# EAGLE design eink_controller (EAGLE 7.2.0)
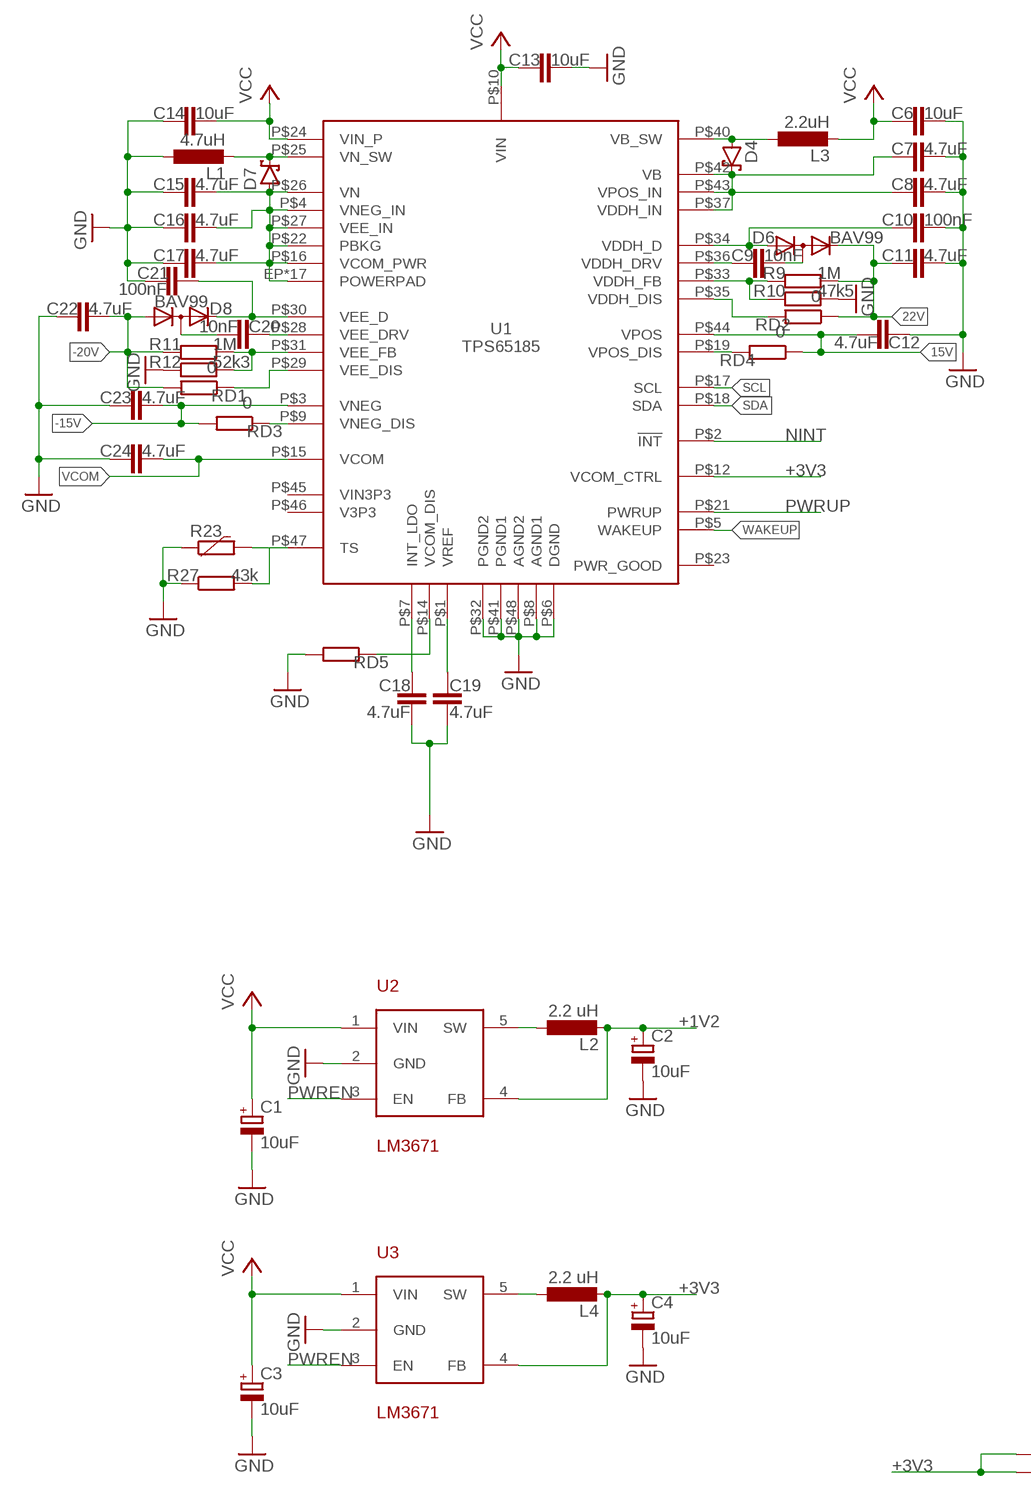
[diagram p0: schematic, sheet 1, part 1 of 2]
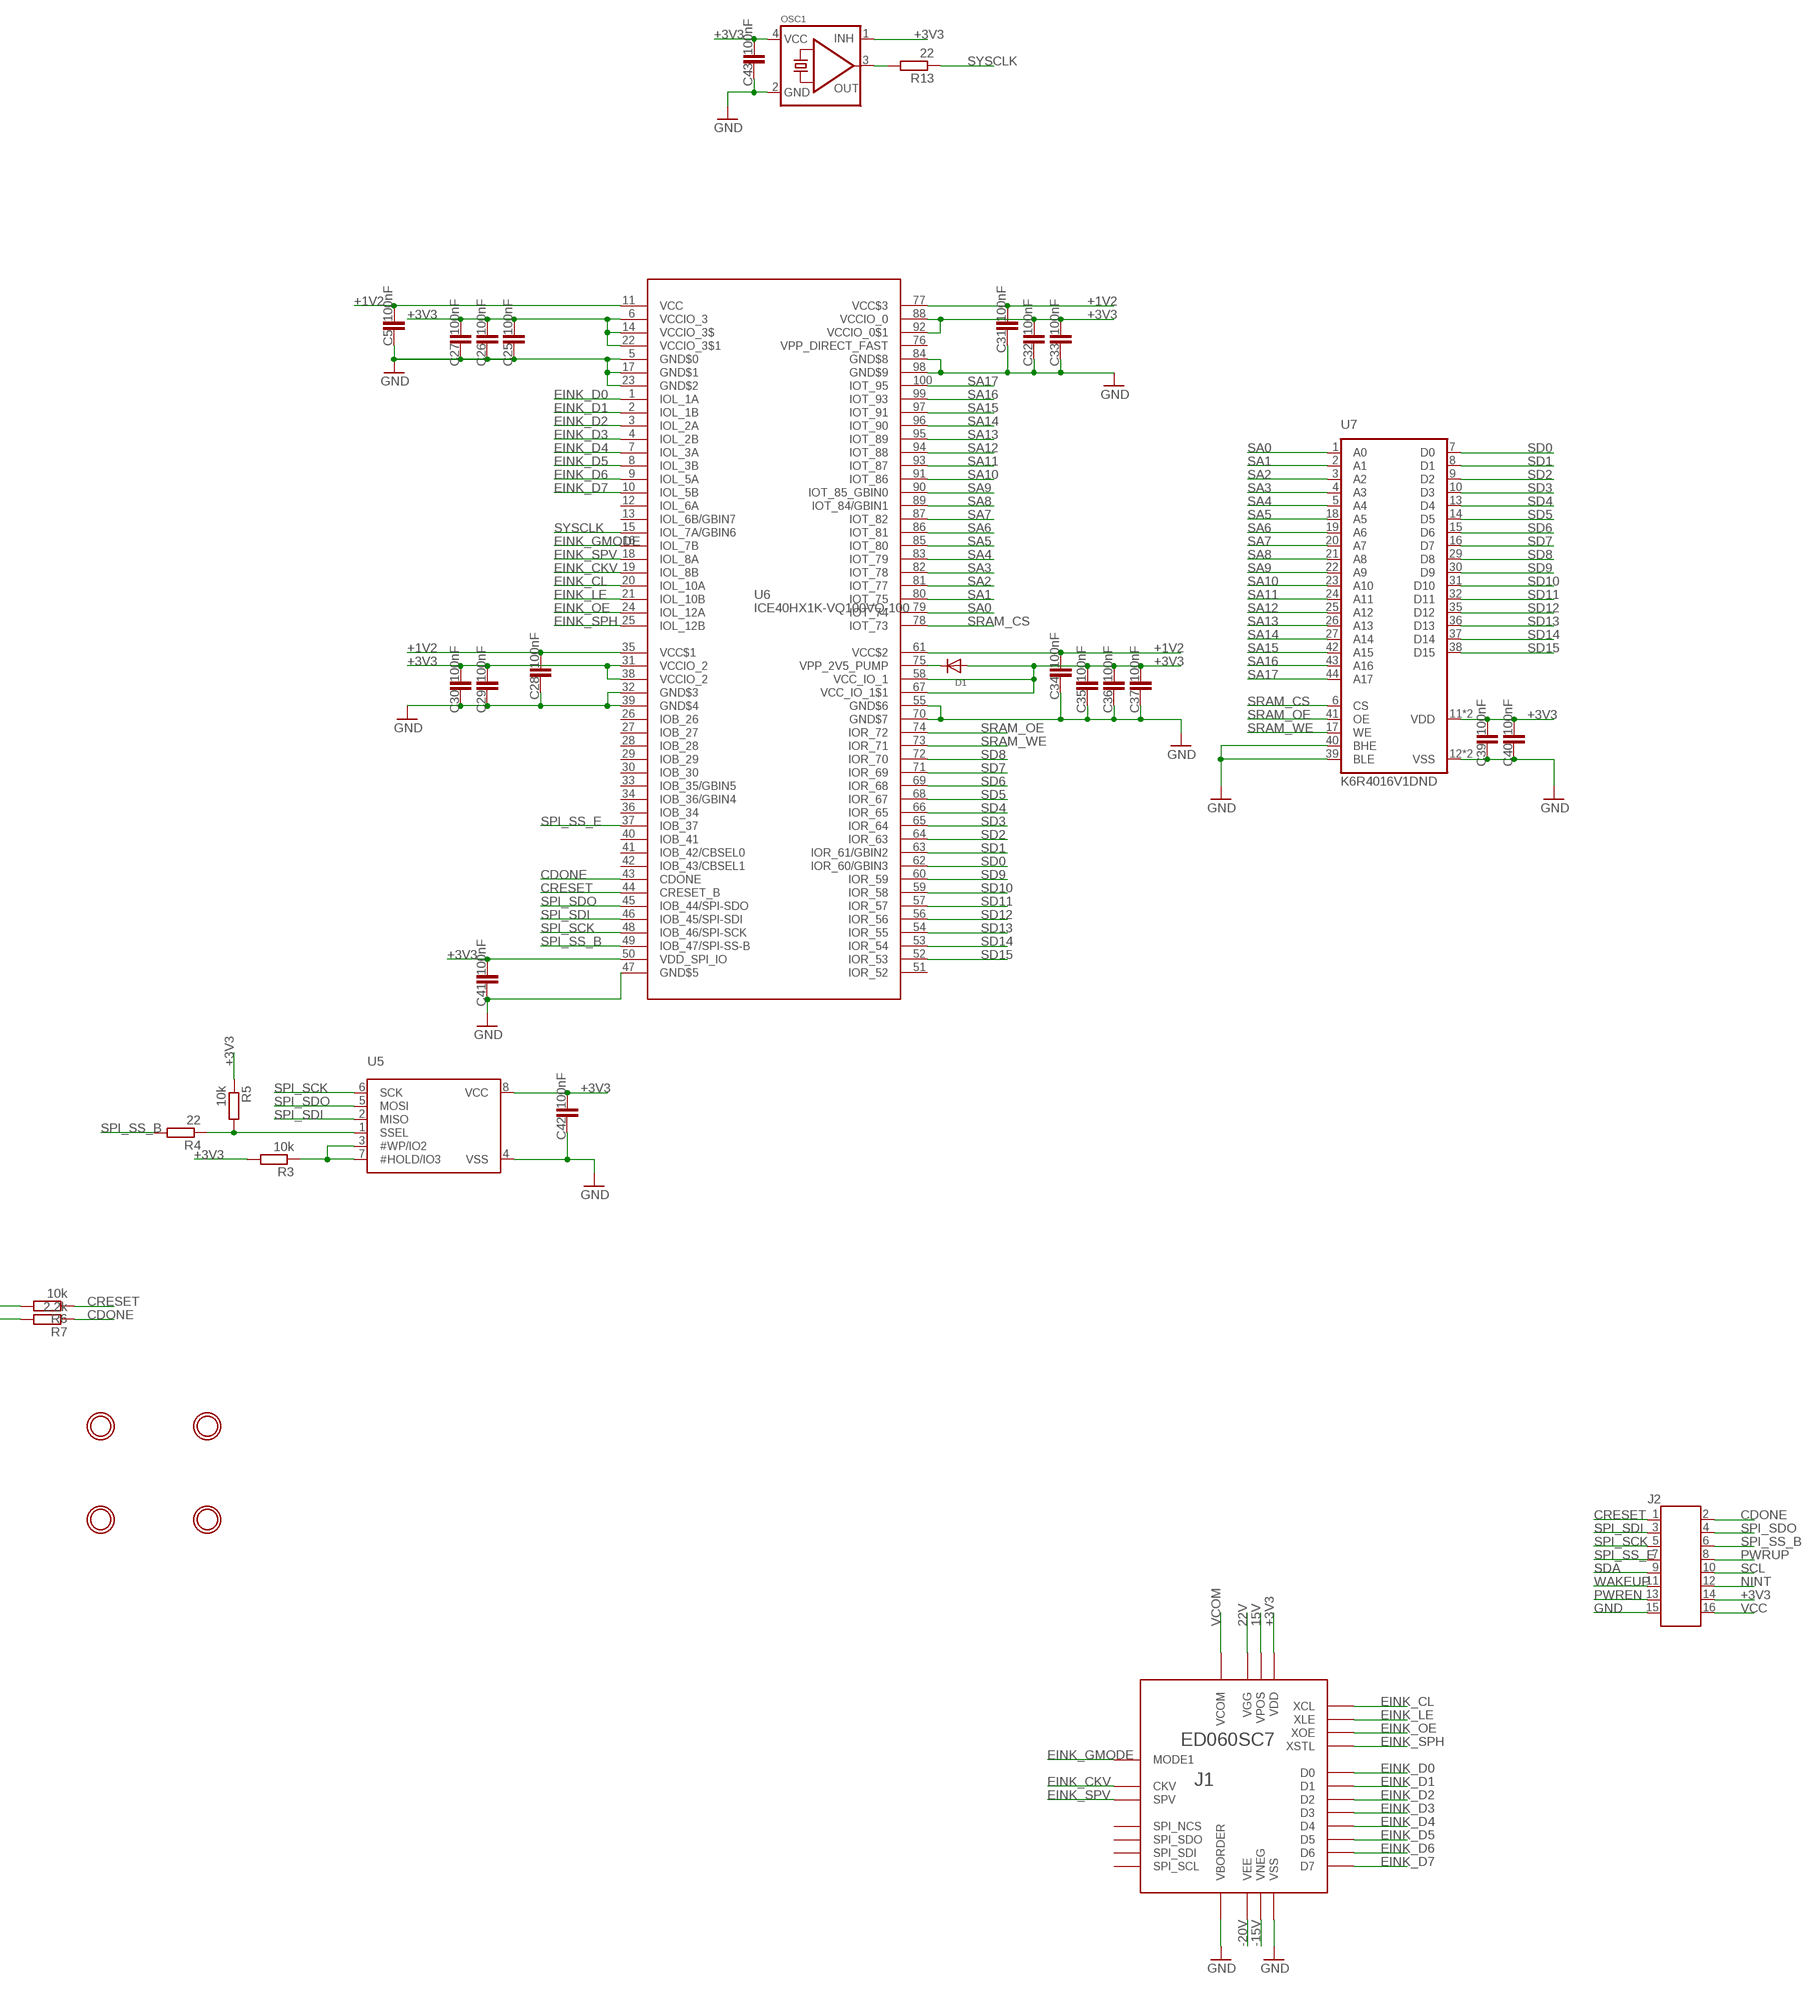
[diagram p1: schematic, sheet 1, part 2 of 2]

## Parts
C1  10uF  CPOL-EUA/3216-18R  [A/3216-18R]
C2  10uF  CPOL-EUA/3216-18R  [A/3216-18R]
C3  10uF  CPOL-EUA/3216-18R  [A/3216-18R]
C4  10uF  CPOL-EUA/3216-18R  [A/3216-18R]
C5  100nF  C-EUC0603K  [C0603K]
C6  10uF  C-EUC0805K  [C0805K]
C7  4.7uF  C-EUC0805K  [C0805K]
C8  4.7uF  C-EUC0805K  [C0805K]
C9  10nF  C-EUC0603K  [C0603K]
C10  100nF  C-EUC0603K  [C0603K]
C11  4.7uF  C-EUC0603K  [C0603K]
C12  4.7uF  C-EUC0805K  [C0805K]
C13  10uF  C-EUC0805K  [C0805K]
C14  10uF  C-EUC0805K  [C0805K]
C15  4.7uF  C-EUC0805K  [C0805K]
C16  4.7uF  C-EUC0805K  [C0805K]
C17  4.7uF  C-EUC0805K  [C0805K]
C18  4.7uF  C-EUC0805K  [C0805K]
C19  4.7uF  C-EUC0805K  [C0805K]
C20  10nF  C-EUC0603K  [C0603K]
C21  100nF  C-EUC0603K  [C0603K]
C22  4.7uF  C-EUC0603K  [C0603K]
C23  4.7uF  C-EUC0805K  [C0805K]
C24  4.7uF  C-EUC0805K  [C0805K]
C25  100nF  C-EUC0603K  [C0603K]
C26  100nF  C-EUC0603K  [C0603K]
C27  100nF  C-EUC0603K  [C0603K]
C28  100nF  C-EUC0603K  [C0603K]
C29  100nF  C-EUC0603K  [C0603K]
C30  100nF  C-EUC0603K  [C0603K]
C31  100nF  C-EUC0603K  [C0603K]
C32  100nF  C-EUC0603K  [C0603K]
C33  100nF  C-EUC0603K  [C0603K]
C34  100nF  C-EUC0603K  [C0603K]
C35  100nF  C-EUC0603K  [C0603K]
C36  100nF  C-EUC0603K  [C0603K]
C37  100nF  C-EUC0603K  [C0603K]
C39  100nF  C-EUC0603K  [C0603K]
C40  100nF  C-EUC0603K  [C0603K]
C41  100nF  C-EUC0603K  [C0603K]
C42  100nF  C-EUC0603K  [C0603K]
C43  100nF  C-EUC0603K  [C0603K]
D1  DIODESOD-123  [SOD-123]
D4  MBR130T3G  [SOD123]
D6  BAV99  BAV199  [SOT23]
D7  MBR130T3G  [SOD123]
D8  BAV99  BAV199  [SOT23]
J1  ED060SC7  [AXT334124]
J2  610116249221  [610116249221]
L1  4.7uH  L-EUL2825P  [L2825P]
L2  2.2 uH  L-EUL2825P  [L2825P]
L3  2.2uH  L-EUL2825P  [L2825P]
L4  2.2 uH  L-EUL2825P  [L2825P]
OSC1  OSCILLATOR  [OSC_7X5MM]
R3  10k  R-EU_R0603  [R0603]
R4  22  R-EU_R0603  [R0603]
R5  10k  R-EU_R0603  [R0603]
R6  10k  R-EU_R0603  [R0603]
R7  2.2k  R-EU_R0603  [R0603]
R9  1M  R-EU_R0603  [R0603]
R10  47k5  R-EU_R0603  [R0603]
R11  1M  R-EU_R0603  [R0603]
R12  52k3  R-EU_R0603  [R0603]
R13  22  R-EU_R0603  [R0603]
R23  R-EU_R0603  [R0603]
R27  43k  R-EU_R0603  [R0603]
RD1  0  R-EU_R0603  [R0603]
RD2  0  R-EU_R0603  [R0603]
RD3  0  R-EU_R0603  [R0603]
RD4  0  R-EU_R0603  [R0603]
RD5  R-EU_R0603  [R0603]
U1  TPS65185  [VQFN48]
U2  LM3671  [SOT23-5]
U3  LM3671  [SOT23-5]
U5  SPIFLASH_SOIC8208MIL  [SOIC8_208MIL]
U6  ICE40HX1K-VQ100VQ-100  [TQFP100]
U7  K6R4016V1DND  [TSOP44-II]
U$1  MOUNTINGHOLE2.0  [MOUNTINGHOLE_2.0_PLATED]
U$2  MOUNTINGHOLE2.0  [MOUNTINGHOLE_2.0_PLATED]
U$3  MOUNTINGHOLE2.0  [MOUNTINGHOLE_2.0_PLATED]
U$4  MOUNTINGHOLE2.0  [MOUNTINGHOLE_2.0_PLATED]

## Nets
15V: C12.2 J1.P$2(VPOS) J1.P$4(VPOS) RD4.1 U1.P$44(VPOS)
22V: C11.1 D6.2(C) J1.P$25(VGG) R9.2 RD2.1
+1V2: C2.+ C5.2 C28.2 C31.2 C34.2 L2.2 U2.4(FB) U6.11(VCC) U6.35(VCC$1) U6.61(VCC$2) U6.77(VCC$3)
+3V3: C4.+ C25.2 C26.2 C27.2 C29.2 C30.2 C32.2 C33.2 C35.2 C36.2 C37.2 C39.2 C40.2 C41.2 C42.2 C43.2 D1.A J1.P$5(VDD) J1.P$7(VDD) J2.14 L4.2 OSC1.1(INH) OSC1.4(VCC) R3.2 R5.1 R6.2 R7.2 U1.P$12(VCOM_CTRL) U3.4(FB) U5.8(VCC) U6.6(VCCIO_3) U6.14(VCCIO_3$) U6.22(VCCIO_3$1) U6.31(VCCIO_2) U6.38(VCCIO_2) U6.50(VDD_SPI_IO) U6.58(VCC_IO_1) U6.67(VCC_IO_1$1) U6.88(VCCIO_0) U6.92(VCCIO_0$1) U7.11(VDD) U7.33(VDD)
-15V: C23.2 J1.P$1(VNEG) J1.P$3(VNEG) RD3.2 U1.P$3(VNEG)
-20V: C22.2 D8.1(A) J1.P$27(VEE) J1.P$29(VEE) R11.1 RD1.2
CDONE: J2.2 R7.1 U6.43(CDONE)
CRESET: J2.1 R6.1 U6.44(CRESET_B)
EINK_CKV: J1.P$28(CKV) U6.19(IOL_8B)
EINK_CL: J1.P$9(XCL) U6.20(IOL_10A)
EINK_D0: J1.P$13(D0) U6.1(IOL_1A)
EINK_D1: J1.P$14(D1) U6.2(IOL_1B)
EINK_D2: J1.P$15(D2) U6.3(IOL_2A)
EINK_D3: J1.P$16(D3) U6.4(IOL_2B)
EINK_D4: J1.P$17(D4) U6.7(IOL_3A)
EINK_D5: J1.P$18(D5) U6.8(IOL_3B)
EINK_D6: J1.P$19(D6) U6.9(IOL_5A)
EINK_D7: J1.P$20(D7) U6.10(IOL_5B)
EINK_GMODE: J1.P$26(MODE1) U6.16(IOL_7B)
EINK_LE: J1.P$10(XLE) U6.21(IOL_10B)
EINK_OE: J1.P$11(XOE) U6.24(IOL_12A)
EINK_SPH: J1.P$12(XSTL) U6.25(IOL_12B)
EINK_SPV: J1.P$30(SPV) U6.18(IOL_8A)
GND: C1.- C2.- C3.- C4.- C5.1 C6.2 C7.2 C8.2 C10.2 C11.2 C12.1 C13.2 C14.1 C15.1 C16.1 C17.1 C18.1 C19.1 C21.1 C22.1 C23.1 C24.1 C25.1 C26.1 C27.1 C28.1 C29.1 C30.1 C31.1 C32.1 C33.1 C34.1 C35.1 C36.1 C37.1 C39.1 C40.1 C41.1 C42.1 C43.1 J1.P$6(VSS) J1.P$8(VSS) J1.P$31(VSS) J1.P$32(VBORDER) J2.15 L1.1 OSC1.2(GND) R10.2 R12.1 R23.1 R27.1 RD5.2 U1.P$6(DGND) U1.P$8(AGND1) U1.P$32(PGND2) U1.P$41(PGND1) U1.P$48(AGND2) U2.2(GND) U3.2(GND) U5.4(VSS) U6.5(GND$0) U6.17(GND$1) U6.23(GND$2) U6.32(GND$3) U6.39(GND$4) U6.47(GND$5) U6.55(GND$6) U6.70(GND$7) U6.84(GND$8) U6.98(GND$9) U7.12(VSS) U7.34(VSS) U7.39(BLE) U7.40(BHE)
N$1: RD5.1 U1.P$14(VCOM_DIS)
N$2: L4.1 U3.5(SW)
N$5: R3.1 U5.3(#WP/IO2) U5.7(#HOLD/IO3)
N$6: OSC1.3(OUT) R13.2
N$7: D4.2(A) L3.1 U1.P$40(VB_SW)
N$8: D1.C U6.75(VPP_2V5_PUMP)
N$9: L2.1 U2.5(SW)
N$10: R4.1 R5.2 U5.1(SSEL)
N$14: C7.1 C8.1 D4.1(C) U1.P$37(VDDH_IN) U1.P$42(VB) U1.P$43(VPOS_IN)
N$18: C10.1 D6.1(A) U1.P$34(VDDH_D)
N$20: C9.1 U1.P$36(VDDH_DRV)
N$21: C9.2 D6.3(AC)
N$22: R9.1 R10.1 U1.P$33(VDDH_FB)
N$23: C20.2 D8.3(AC)
N$24: D7.1(C) L1.2 U1.P$25(VN_SW)
N$25: C15.2 C16.2 C17.2 D7.2(A) U1.EP1(POWERPAD) U1.EP2(POWERPAD) U1.EP3(POWERPAD) U1.EP4(POWERPAD) U1.EP5(POWERPAD) U1.EP6(POWERPAD) U1.EP7(POWERPAD) U1.EP8(POWERPAD) U1.EP9(POWERPAD) U1.EP10(POWERPAD) U1.EP11(POWERPAD) U1.EP12(POWERPAD) U1.EP13(POWERPAD) U1.EP14(POWERPAD) U1.EP15(POWERPAD) U1.EP16(POWERPAD) U1.EP(POWERPAD) U1.P$4(VNEG_IN) U1.P$16(VCOM_PWR) U1.P$22(PBKG) U1.P$26(VN) U1.P$27(VEE_IN)
N$26: C18.2 U1.P$7(INT_LDO)
N$27: C19.2 U1.P$1(VREF)
N$28: C21.2 D8.2(C) U1.P$30(VEE_D)
N$29: RD3.1 U1.P$9(VNEG_DIS)
N$31: C20.1 U1.P$28(VEE_DRV)
N$32: R11.2 R12.2 U1.P$31(VEE_FB)
N$33: RD1.1 U1.P$29(VEE_DIS)
N$34: RD4.2 U1.P$19(VPOS_DIS)
N$35: RD2.2 U1.P$35(VDDH_DIS)
N$57: R23.2 R27.2 U1.P$47(TS)
NINT: J2.12 U1.P$2(!INT)
PWREN: J2.13 U2.3(EN) U3.3(EN)
PWRUP: J2.8 U1.P$21(PWRUP)
SA0: U6.79(IOT_74) U7.1(A0)
SA1: U6.80(IOT_75) U7.2(A1)
SA2: U6.81(IOT_77) U7.3(A2)
SA3: U6.82(IOT_78) U7.4(A3)
SA4: U6.83(IOT_79) U7.5(A4)
SA5: U6.85(IOT_80) U7.18(A5)
SA6: U6.86(IOT_81) U7.19(A6)
SA7: U6.87(IOT_82) U7.20(A7)
SA8: U6.89(IOT_84/GBIN1) U7.21(A8)
SA9: U6.90(IOT_85_GBIN0) U7.22(A9)
SA10: U6.91(IOT_86) U7.23(A10)
SA11: U6.93(IOT_87) U7.24(A11)
SA12: U6.94(IOT_88) U7.25(A12)
SA13: U6.95(IOT_89) U7.26(A13)
SA14: U6.96(IOT_90) U7.27(A14)
SA15: U6.97(IOT_91) U7.42(A15)
SA16: U6.99(IOT_93) U7.43(A16)
SA17: U6.100(IOT_95) U7.44(A17)
SCL: J2.10 U1.P$17(SCL)
SD0: U6.62(IOR_60/GBIN3) U7.7(D0)
SD1: U6.63(IOR_61/GBIN2) U7.8(D1)
SD2: U6.64(IOR_63) U7.9(D2)
SD3: U6.65(IOR_64) U7.10(D3)
SD4: U6.66(IOR_65) U7.13(D4)
SD5: U6.68(IOR_67) U7.14(D5)
SD6: U6.69(IOR_68) U7.15(D6)
SD7: U6.71(IOR_69) U7.16(D7)
SD8: U6.72(IOR_70) U7.29(D8)
SD9: U6.60(IOR_59) U7.30(D9)
SD10: U6.59(IOR_58) U7.31(D10)
SD11: U6.57(IOR_57) U7.32(D11)
SD12: U6.56(IOR_56) U7.35(D12)
SD13: U6.54(IOR_55) U7.36(D13)
SD14: U6.53(IOR_54) U7.37(D14)
SD15: U6.52(IOR_53) U7.38(D15)
SDA: J2.9 U1.P$18(SDA)
SPI_SCK: J2.5 U5.6(SCK) U6.48(IOB_46/SPI-SCK)
SPI_SDI: J2.3 U5.2(MISO) U6.46(IOB_45/SPI-SDI)
SPI_SDO: J2.4 U5.5(MOSI) U6.45(IOB_44/SPI-SDO)
SPI_SS_B: J2.6 R4.2 U6.49(IOB_47/SPI-SS-B)
SPI_SS_E: J2.7 U6.37(IOB_37)
SRAM_CS: U6.78(IOT_73) U7.6(CS)
SRAM_OE: U6.74(IOR_72) U7.41(OE)
SRAM_WE: U6.73(IOR_71) U7.17(WE)
SYSCLK: R13.1 U6.15(IOL_7A/GBIN6)
VCC: C1.+ C3.+ C6.1 C13.1 C14.2 J2.16 L3.2 U1.P$10(VIN) U1.P$24(VIN_P) U2.1(VIN) U3.1(VIN)
VCOM: C24.2 J1.P$21(VCOM) J1.P$23(VCOM) U1.P$15(VCOM)
WAKEUP: J2.11 U1.P$5(WAKEUP)
Unconnected: J1.P$22(SPI_SCL) J1.P$24(SPI_SDI) J1.P$33(SPI_NCS) J1.P$34(SPI_SDO) U1.P$23(PWR_GOOD) U1.P$45(VIN3P3) U1.P$46(V3P3) U6.12(IOL_6A) U6.13(IOL_6B/GBIN7) U6.26(IOB_26) U6.27(IOB_27) U6.28(IOB_28) U6.29(IOB_29) U6.30(IOB_30) U6.33(IOB_35/GBIN5) U6.34(IOB_36/GBIN4) U6.36(IOB_34) U6.40(IOB_41) U6.41(IOB_42/CBSEL0) U6.42(IOB_43/CBSEL1) U6.51(IOR_52)

## Power pins joined to a net without a drawn wire
VPP_DIRECT_FAST: U6.76(VPP_DIRECT_FAST)

## Library data of the parts
C1-C4 = rcl:CPOL-EU: POLARIZED CAPACITOR, European symbol
C5-C37 C39-C43 = rcl:C-EU: CAPACITOR, European symbol
D1 = adafruit:DIODE: Diode SMADIODE - SMA Surface Mount Package 20V 1A Schottky Diode Digikey: 641-1014-6-ND DO-1N4148 - Through Hole Small Current Diode SOD-123 20V 1 A (.5mV Vf) Schottky Diode - Digikey: MBRX120TPMSCT-ND SOD-323 10V 570mA (.38mV Vf, 3ns) Schottky Diode - Digikey: ZLLS410CT-ND SOD-523 30V 30mA Schottky Diode (RB751S-40TE61) - Digikey: RB751S-40TE61CT-ND SOT23-R/W - SOT23 Package (R = Solder Paste/Reflow Ovens, W = Hand-Soldering) BAT54Film 40V 300mA - Digikey: 497-7162-1-ND
D4 D7 = aalectronics:MBR130T3G
D6 D8 = diode:BAV199: DIODE low-leakage double diode
J1 = AXT334124:ED060SC7
J2 = Wurth_Elektronik_Electromechanic_Board_to_Board_Connectors_rev16b:610116249221: WR-PHD 2.54 mm Dual Socket Header 16 pins, dual pin, SMT horizontal, gold plating ;=>Code : Con_BTB_SHD_2.54_2_6101xx249221_610116249221 <http://katalog.we-online.de/media/images/eican/Con_BTB_SHD_2.54_2_6101xx249221_pf2.jpg> Details see: http://katalog.we-online.de/em/datasheet/6101xx249221.pdf Created 2014-10-08, Karrer Zheng 2014 (C) Wurth Elektronik
L1-L4 = rcl:L-EU: INDUCTOR, European symbol
OSC1 = microbuilder:OSCILLATOR: Oscillators 3.2x2.5mm SMT 4.0MHz +/- 50ppm, 3.3V, 9mA, -40/+85°C - Digikey: 535-9752-1-ND 50MHz +/- 50ppm, 3.3V, 8mA, -10/+70°C - Digikey: 478-4792-1-ND 5x7mm SMT 4.0MHz +/-20ppm 3.3V, 20mA, -20/+70°C - Digikey: 535-9329-2-ND 50MHz +/- 25ppm 3.3V, 35mA, -40/+85°C - Digikey: 631-1197-1-ND
R3-R7 R9-R13 R23 R27 RD1-RD5 = rcl:R-EU_: RESISTOR, European symbol
U1 = aalectronics:TPS65185
U2 U3 = texas-custom:LM3671: Texas Instruments LM3671, LM3671Q 2MHz, 600mA Step-Down DC-DC Converter
U5 = microbuilder:SPIFLASH_SOIC8: SOIC8 SPI Flash Be careful with the size since SOIC8 flash comes in several 'widths' SOIC8 150 mil M25P16 - 16Mbit (2Mbit x 8) Serial Flash (75MHz SPI Bus), Supply: 2.7-3.6V Digikey: SOIC8 - M25P16-VMN6P-ND SOIC8 208 mil W25Q16BVSSIG - 16Mbit (2Mbit x 8) Serial Flash (104MHz SPI Bus), Supply: 2.7-3.6V Digikey: SOIC8 - W25Q16BVSSIG-ND
U6 = ice40hx1k-vq100-2:ICE40HX1K-VQ100: FPGA - Field Programmable Gate Array iCE40HX 1280 LUTs, 1.2V Ultra Low-Power, TQFP/VQ-100 package
U7 = sram-256x16:K6R4016V1D: 4 Mbit (256K x16) 3.0V Asynchronous SRAM; OC_FARNELL: unknown; OC_NEWARK: unknown
U$1-U$4 = microbuilder:MOUNTINGHOLE: Mounting Hole For #2 screws (0.086"/2.18mm width, 0.094"/2.4mm hole) use 2.5mm

## Net classes
2 VCC: width 0.305 mm
3 VBUS: width 0.508 mm

## Board
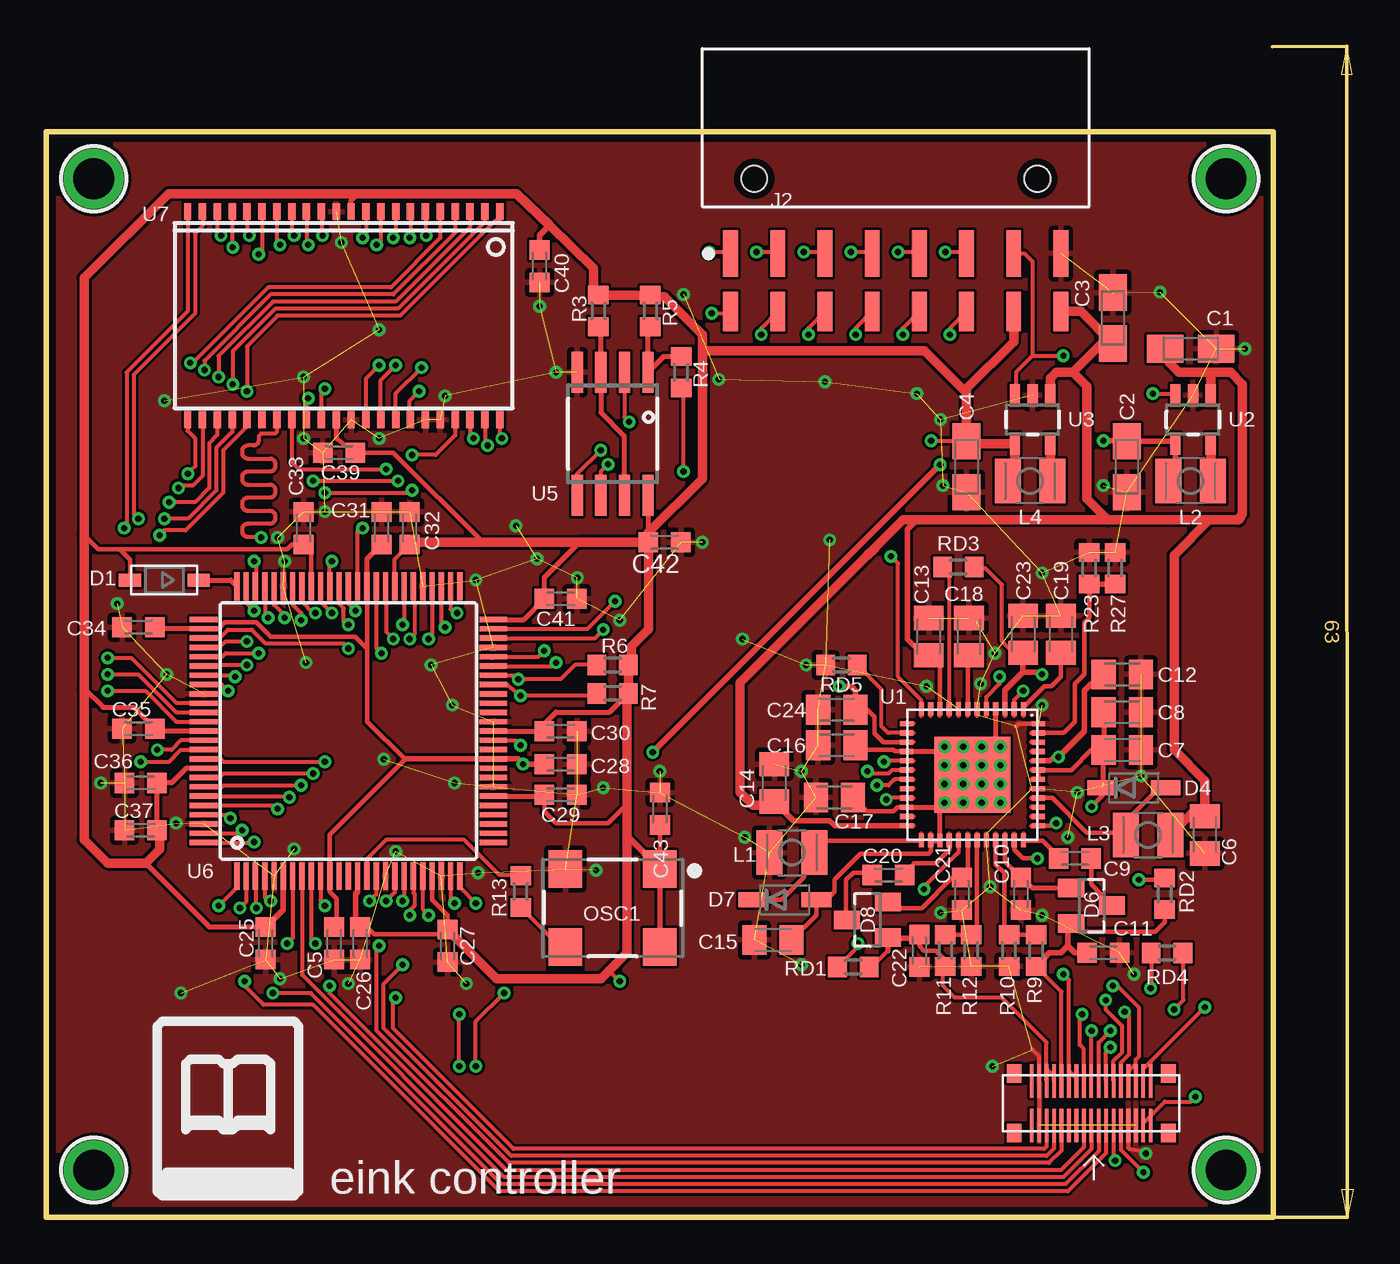
[diagram p2: board, top side]
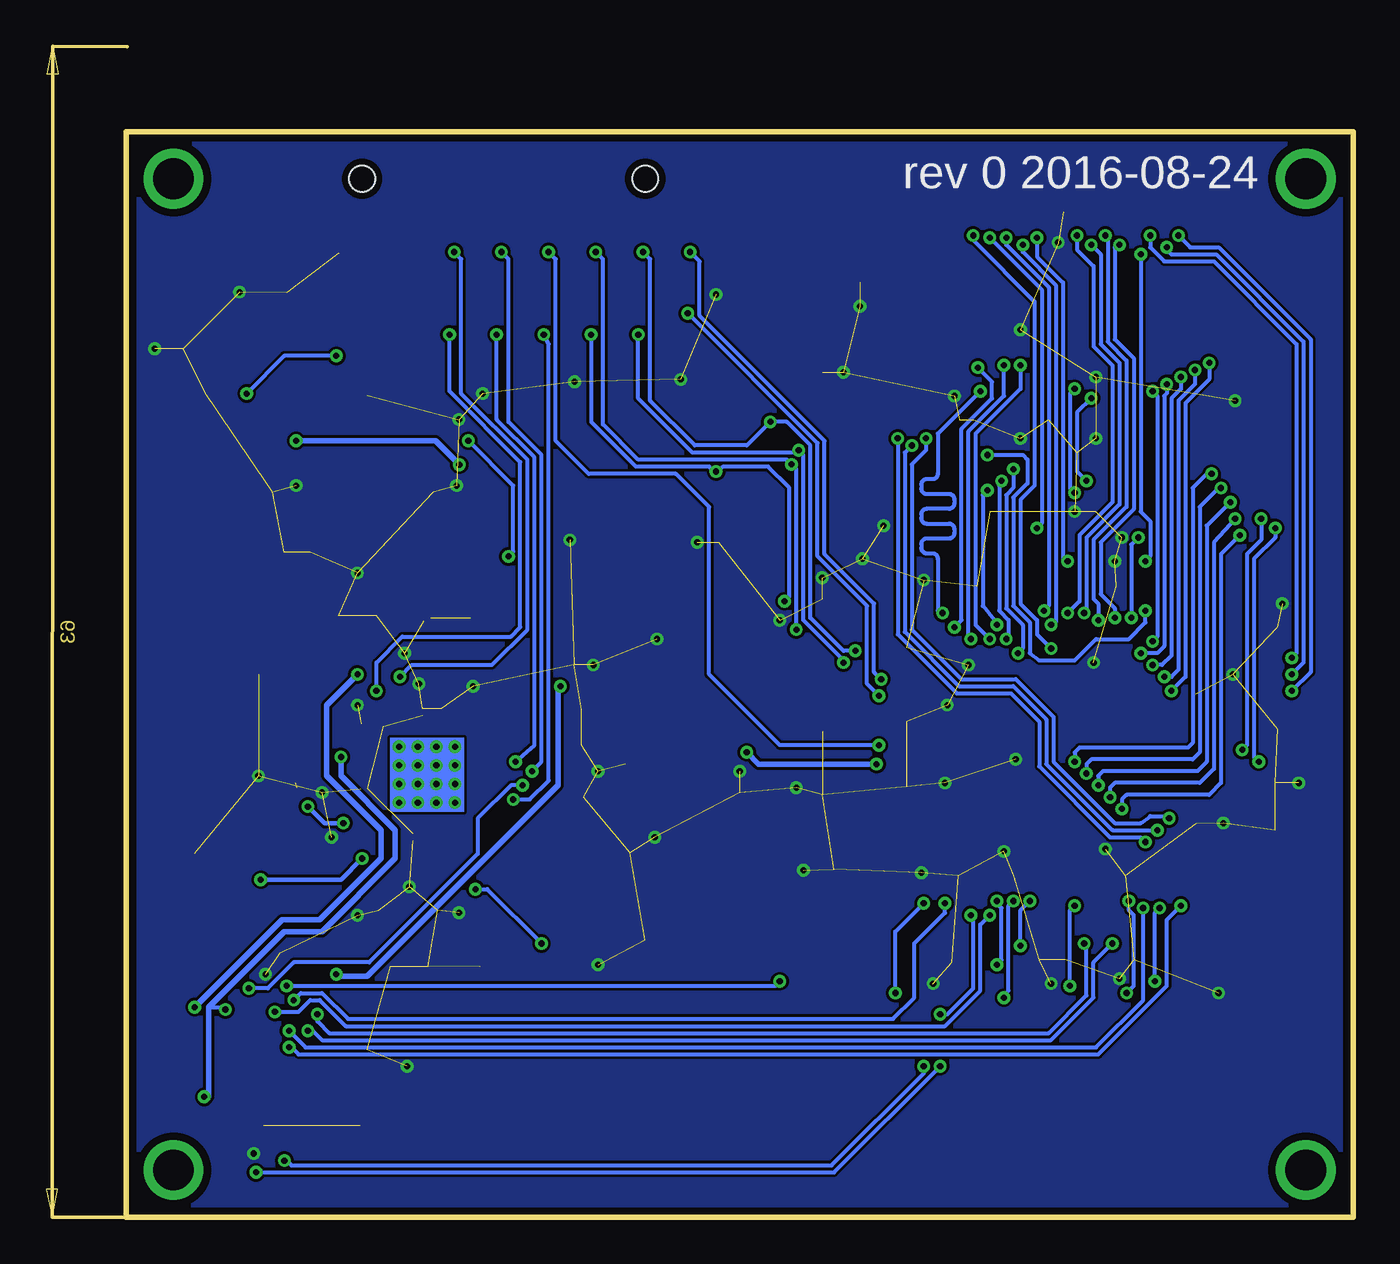
[diagram p3: board, bottom side, seen from below]

Size 66.04 x 58.42 mm. Coordinates in mm from the lower left corner, seen from the top.
Outline: 0,0 0,58.42 66.04,58.42 66.04,0 0,0
Copper layers (1*16): Top 0.0356mm / dielectric 1.5011mm / Bottom 0.0356mm
Design rules "LaenPCBOrder": minimum track width 6mil, minimum drill 13mil, track to track 6mil, track to pad 6mil, pad to pad 6mil, via to via 6mil, smd to smd 6mil, copper to edge 15mil, drill to drill 6mil, minimum pad ring 7mil, minimum via ring 7mil, stop-mask expansion 3mil, vias tented up to drill 0mil, thermal gap 10mil

### Footprints (pad centres in the part's own frame; a part is rotated, then mirrored left to right if it is on the bottom)
A/3216-18R = smd 1.95 x 1.5: + 1.375,0; - -1.375,0
C0603K = smd 1.05 x 1.08: 1 -0.875,0; 2 0.875,0
C0805K = smd 1.3 x 1.6: 1 -1,0; 2 1,0
SOD-123 = smd 1.2 x 0.7: A 1.85,0; C -1.85,0
SOD123 = smd 1.6 x 0.8: 1 -1.7,0; 2 1.7,0
SOT23 = smd 1 x 1.4: 1 -0.95,-1.1; 2 0.95,-1.1; 3 0,1.1
AXT334124 = smd 0.2 x 1.8: P$1 1.518,0.284; P$2 1.518,2.684; P$3 1.918,0.284; P$4 1.918,2.684; P$5 2.318,0.284; P$6 2.318,2.684; P$7 2.718,0.284; P$8 2.718,2.684; P$9 3.118,0.284; P$10 3.118,2.684; P$11 3.518,0.284; P$12 3.518,2.684; P$13 3.918,0.284; P$14 3.918,2.684; P$15 4.318,0.284; P$16 4.318,2.684; P$17 4.718,0.284; P$18 4.718,2.684; P$19 5.118,0.284; P$20 5.118,2.684; P$21 5.518,0.284; P$22 5.518,2.684; P$23 5.918,0.284; P$24 5.918,2.684; P$25 6.318,0.284; P$26 6.318,2.684; P$27 6.718,0.284; P$28 6.718,2.684; P$29 7.118,0.284; P$30 7.118,2.684; P$31 7.518,0.284; P$32 7.518,2.684; P$33 7.918,0.284; P$34 7.918,2.684 | smd 0.8 x 1: TERM$1 0.568,3.084; TERM$2 0.568,-0.116; TERM$3 8.868,3.084; TERM$4 8.868,-0.116
610116249221 = smd 0.8 x 2.5: 1 -8.89,-4.01; 3 -6.35,-4.01; 5 -3.81,-4.01; 7 -1.27,-4.01; 9 1.27,-4.01; 11 3.81,-4.01; 13 6.35,-4.01; 15 8.89,-4.01 | smd 0.8 x 2.1: 2 -8.89,-7.14; 4 -6.35,-7.14; 6 -3.81,-7.14; 8 -1.27,-7.14; 10 1.27,-7.14; 12 3.81,-7.14; 14 6.35,-7.14; 16 8.89,-7.14 | hole 1.4: -7.62,0; 7.62,0
L2825P = smd 1.4 x 2.4: 1 -1.2,0; 2 1.2,0
OSC_7X5MM = smd 1.8 x 2: 1 -2.54,-2.1; 2 2.54,-2.1; 3 2.54,2.1; 4 -2.54,2.1
R0603 = smd 1 x 1.1: 1 -0.85,0; 2 0.85,0
VQFN48 = smd 4.1 x 4.1: EP 0,0 | drill 0.33: EP1 -1.5,1.5; EP2 -0.5,1.5; EP3 0.5,1.5; EP4 1.5,1.5; EP5 1.5,0.5; EP6 1.5,-0.5; EP7 1.5,-1.5; EP8 0.5,-1.5; EP9 -0.5,-1.5; EP10 -1.5,-1.5; EP11 -1.5,-0.5; EP12 -1.5,0.5; EP13 0.5,-0.5; EP14 -0.5,0.5; EP15 0.5,0.5; EP16 -0.5,-0.5 | smd 0.71 x 0.28: P$1 -3.545,2.75; P$2 -3.545,2.25; P$3 -3.545,1.75; P$4 -3.545,1.25; P$5 -3.545,0.75; P$6 -3.545,0.25; P$7 -3.545,-0.25; P$8 -3.545,-0.75; P$9 -3.545,-1.25; P$10 -3.545,-1.75; P$11 -3.545,-2.25; P$12 -3.545,-2.75; P$25 3.545,-2.75; P$26 3.545,-2.25; P$27 3.545,-1.75; P$28 3.545,-1.25; P$29 3.545,-0.75; P$30 3.545,-0.25; P$31 3.545,0.25; P$32 3.545,0.75; P$33 3.545,1.25; P$34 3.545,1.75; P$35 3.545,2.25; P$36 3.545,2.75 | smd 0.28 x 0.71: P$13 -2.75,-3.545; P$14 -2.25,-3.545; P$15 -1.75,-3.545; P$16 -1.25,-3.545; P$17 -0.75,-3.545; P$18 -0.25,-3.545; P$19 0.25,-3.545; P$20 0.75,-3.545; P$21 1.25,-3.545; P$22 1.75,-3.545; P$23 2.25,-3.545; P$24 2.75,-3.545; P$37 2.75,3.545; P$38 2.25,3.545; P$39 1.75,3.545; P$40 1.25,3.545; P$41 0.75,3.545; P$42 0.25,3.545; P$43 -0.25,3.545; P$44 -0.75,3.545; P$45 -1.25,3.545; P$46 -1.75,3.545; P$47 -2.25,3.545; P$48 -2.75,3.545
SOT23-5 = smd 0.55 x 1.2: 1 -0.95,-1.3; 2 0,-1.3; 3 0.95,-1.3; 4 0.95,1.3; 5 -0.95,1.3
SOIC8_208MIL = smd 0.6 x 2.2: 1 -1.905,-3.315; 2 -0.635,-3.315; 3 0.635,-3.315; 4 1.905,-3.315; 5 1.905,3.315; 6 0.635,3.315; 7 -0.635,3.315; 8 -1.905,3.315
TQFP100 = smd 1.5 x 0.285: 1 -7.8,6; 2 -7.8,5.5; 3 -7.8,5; 4 -7.8,4.5; 5 -7.8,4; 6 -7.8,3.5; 7 -7.8,3; 8 -7.8,2.5; 9 -7.8,2; 10 -7.8,1.5; 11 -7.8,1; 12 -7.8,0.5; 13 -7.8,0; 14 -7.8,-0.5; 15 -7.8,-1; 16 -7.8,-1.5; 17 -7.8,-2; 18 -7.8,-2.5; 19 -7.8,-3; 20 -7.8,-3.5; 21 -7.8,-4; 22 -7.8,-4.5; 23 -7.8,-5; 24 -7.8,-5.5; 25 -7.8,-6; 51 7.8,-6; 52 7.8,-5.5; 53 7.8,-5; 54 7.8,-4.5; 55 7.8,-4; 56 7.8,-3.5; 57 7.8,-3; 58 7.8,-2.5; 59 7.8,-2; 60 7.8,-1.5; 61 7.8,-1; 62 7.8,-0.5; 63 7.8,0; 64 7.8,0.5; 65 7.8,1; 66 7.8,1.5; 67 7.8,2; 68 7.8,2.5; 69 7.8,3; 70 7.8,3.5; 71 7.8,4; 72 7.8,4.5; 73 7.8,5; 74 7.8,5.5; 75 7.8,6 | smd 0.285 x 1.5: 26 -6,-7.8; 27 -5.5,-7.8; 28 -5,-7.8; 29 -4.5,-7.8; 30 -4,-7.8; 31 -3.5,-7.8; 32 -3,-7.8; 33 -2.5,-7.8; 34 -2,-7.8; 35 -1.5,-7.8; 36 -1,-7.8; 37 -0.5,-7.8; 38 0,-7.8; 39 0.5,-7.8; 40 1,-7.8; 41 1.5,-7.8; 42 2,-7.8; 43 2.5,-7.8; 44 3,-7.8; 45 3.5,-7.8; 46 4,-7.8; 47 4.5,-7.8; 48 5,-7.8; 49 5.5,-7.8; 50 6,-7.8; 76 6,7.8; 77 5.5,7.8; 78 5,7.8; 79 4.5,7.8; 80 4,7.8; 81 3.5,7.8; 82 3,7.8; 83 2.5,7.8; 84 2,7.8; 85 1.5,7.8; 86 1,7.8; 87 0.5,7.8; 88 0,7.8; 89 -0.5,7.8; 90 -1,7.8; 91 -1.5,7.8; 92 -2,7.8; 93 -2.5,7.8; 94 -3,7.8; 95 -3.5,7.8; 96 -4,7.8; 97 -4.5,7.8; 98 -5,7.8; 99 -5.5,7.8; 100 -6,7.8
TSOP44-II = smd 0.4 x 0.9: 1 -8.4,-5.6; 2 -7.6,-5.6; 3 -6.8,-5.6; 4 -6,-5.6; 5 -5.2,-5.6; 6 -4.4,-5.6; 7 -3.6,-5.6; 8 -2.8,-5.6; 9 -2,-5.6; 10 -1.2,-5.6; 11 -0.4,-5.6; 12 0.4,-5.6; 13 1.2,-5.6; 14 2,-5.6; 15 2.8,-5.6; 16 3.6,-5.6; 17 4.4,-5.6; 18 5.2,-5.6; 19 6,-5.6; 20 6.8,-5.6; 21 7.6,-5.6; 22 8.4,-5.6; 23 8.4,5.6; 24 7.6,5.6; 25 6.8,5.6; 26 6,5.6; 27 5.2,5.6; 28 4.4,5.6; 29 3.6,5.6; 30 2.8,5.6; 31 2,5.6; 32 1.2,5.6; 33 0.4,5.6; 34 -0.4,5.6; 35 -1.2,5.6; 36 -2,5.6; 37 -2.8,5.6; 38 -3.6,5.6; 39 -4.4,5.6; 40 -5.2,5.6; 41 -6,5.6; 42 -6.8,5.6; 43 -7.6,5.6; 44 -8.4,5.6
MOUNTINGHOLE_2.0_PLATED = drill 2.2 pad 3: P$1 0,0

### Placement (x,y rotation side)
C1  61.59,46.74 180 top
C2  58.17,40.39 90 top
C3  57.4,48.39 270 top
C4  49.53,40.39 90 top
C5  15.49,14.73 90 top
C6  62.36,20.57 270 top
C7  57.91,25.15 0 top
C8  57.91,27.18 0 top
C9  55.37,19.3 0 top
C10  52.45,17.4 270 top
C11  56.9,14.22 0 top
C12  57.91,29.21 180 top
C13  47.5,31.24 90 top
C14  39.18,23.37 270 top
C15  39.12,14.92 0 top
C16  42.55,25.4 0 top
C17  42.42,22.59 0 top
C18  49.66,31.24 270 top
C19  54.61,31.37 270 top
C20  45.34,18.41 180 top
C21  49.28,17.4 90 top
C22  46.99,14.35 90 top
C23  52.58,31.37 270 top
C24  42.55,27.3 0 top
C25  11.81,14.73 90 top
C26  16.89,14.73 90 top
C27  21.59,14.61 90 top
C28  27.69,24.38 180 top
C29  27.69,22.73 180 top
C30  27.69,26.16 180 top
C31  18.03,37.08 270 top
C32  19.56,37.08 270 top
C33  13.84,37.08 270 top
C34  4.95,31.75 0 top
C35  4.95,26.29 0 top
C36  5.08,23.37 0 top
C37  5.08,20.83 0 top
C39  15.75,41.15 0 top
C40  26.54,51.18 90 top
C41  27.69,33.27 180 top
C42  33.27,36.32 180 top
C43  33.02,21.97 270 top
D1  6.35,34.29 180 top
D4  58.55,23.11 0 top
D6  56.26,16.76 270 top
D7  39.75,17.08 0 top
D8  44.2,16 90 top
J1  60.96,7.62 180 top
J2  45.72,55.88 0 top
L1  40.13,19.62 0 top
L2  61.59,39.62 180 top
L3  59.31,20.57 0 top
L4  52.96,39.62 180 top
OSC1  30.48,16.64 180 top
R3  29.72,48.77 90 top
R4  34.16,45.47 270 top
R5  32.51,48.77 270 top
R6  30.48,29.72 0 top
R7  30.48,28.19 0 top
R9  53.28,14.35 270 top
R10  51.82,14.35 270 top
R11  48.39,14.35 90 top
R12  49.78,14.35 90 top
R13  25.53,17.53 270 top
R23  56.13,34.92 270 top
R27  57.53,34.92 270 top
RD1  43.43,13.46 0 top
RD2  60.2,17.4 90 top
RD3  49.09,34.99 0 top
RD4  60.33,14.22 180 top
RD5  42.8,29.72 180 top
U1  49.85,23.81 270 top
U2  61.72,42.93 180 top
U3  53.09,42.93 180 top
U5  30.48,42.16 180 top
U6  16.26,26.16 90 top
U7  16,48.51 180 top
U$1  2.54,2.54 0 top
U$2  63.5,2.54 0 top
U$3  63.5,55.88 0 top
U$4  2.54,55.88 0 top

### Tracks (layer width: path | path; a pad name or v marks a point on that pad's centre or on a via)
15V  (via drill 0.33)
  Top 0.203: J1.P$2 59.44,5.47 | 59.44,5.47 60.2,6.22 61.59,6.22 v61.85,6.48 | J1.P$4 59.04,5.07 59.44,5.47 | v60.71,11.18 61.21,11.68 61.21,14.19 RD4.1
  Top 0.254: 53.04,24.56 U1.P$44
  Top 0.305: U1.P$44 54.03,24.56 54.23,24.77 v54.48,24.77 55.88,26.16 55.88,28.32 56.26,28.7 C12.2
  Top 0.508: 56.62,28.89 C12.2
  Bottom 0.203: 61.59,11.3 60.83,11.3 v60.71,11.18
  Bottom 0.305: v54.48,24.77 54.48,23.75 51.56,20.83 51.56,19.3 55.5,15.37 57.53,15.37 61.59,11.3 61.59,6.48 v61.85,6.48
22V
  Top 0.203: J1.P$25 54.64,12.14 R9.2
  Top 0.254: D6.2 55.61,15.37 59.69,15.37 60.2,15.88 RD2.1
  Top 0.305: 54.99,14.61 54.99,15.38 D6.2 | 54.99,14.61 54.61,14.22 54,14.22 R9.2 | C11.1 55.37,14.22 54.99,14.61
+1V2  (via drill 0.33)
  Top 0.254: 9.26,31.66 9.6,32 11.3,32 12.06,31.24 16.62,31.24 17.27,30.59 | 17.27,30.59 17.27,26.67 19.28,24.66 19.33,24.66 15.24,20.57 15.24,18.38 15.24,17.53 15.62,17.14 15.62,15.86 C5.2 | 17.27,30.59 17.27,33.95 U6.61
  Top 0.279: 15.24,18.38 U6.11 | U6.61 17.26,35.43 C31.2 | C34.2 5.99,31.66 U6.77 9.26,31.66
  Top 0.305: C28.2 v25.65,24.38 25.38,24.66 U6.35 19.33,24.66 | v48.11,40.49 v32.64,25.02 | v56.9,41.78 58.17,41.78 C2.+ 60.59,41.75 U2.4 60.77,40 L2.2
  Bottom 0.305: v32.64,25.02 32,24.38 v25.65,24.38 | v56.9,41.78 49.4,41.78 v48.11,40.49
+3V3  (via drill 0.33)
  Top 0.203: U6.58 18.76,35.41 C32.2 19.54,36.32 | v57.4,12.45 57.66,12.45 58.8,11.3 58.8,8.64 58.64,8.48 58.64,8.26 | v30.86,12.7 30.29,13.27 | 58.24,8.11 J1.P$7 58.24,7.86 58.64,8.26 | J1.P$5 58.64,8.26 | U1.P$12 47.1,27.83 45.85,29.08 45.85,35.18 v45.47,35.56 | v47.62,41.78 49.51,41.78 C4.+
  Top 0.254: C39.2 18.67,41.15 23.5,36.32 | C33.2 13.83,35.94 | C33.2 13.22,36.21 12.95,35.94 3.94,35.94 | 3.94,35.94 2.79,35.94 2.03,36.7 | D1.A 4.5,35.38 3.94,35.94 | U6.67 14.26,36.05 C33.2 | C26.2 17.03,15.86 17.65,15.24 21.1,15.24 C27.2 21.59,16.26 20.76,17.09 U6.22 | C43.2 OSC1.1 | C29.2 26.81,21.83 27.43,21.21 30.23,21.21 31.24,22.23
  Top 0.279: 31.24,28.11 30.31,27.18 27.43,27.18 26.81,26.56 C30.2 U6.38 | U6.31 26.75,22.66 C29.2 | U6.50 25.7,32.16 C41.2 26.81,34.43 28.7,36.32 | 16.76,15.87 C26.2 | C37.2 C36.2 6.73,23.37 7.53,24.16 U6.92 | C25.2 8.78,15.61 5.33,19.05 | U7.33 15.6,41.91 C39.2 | U7.11 16.4,54.72 16.76,55.09 | 2.03,28.45 3.05,27.43 4.68,27.43 C35.2 5.96,26.16 U6.88 | D1.A 4.95,34.29 | U5.8 32.38,36.83 32.38,36.34
  Top 0.305: C40.2 26.54,52.84 27.07,53.38 | U6.14 16.76,17.52 16.64,17.4 16.64,15.99 C26.2 | 31.24,20.52 OSC1.1 OSC1.4 | U6.6 12.76,16.55 C25.2
  Top 0.406: 30.48,13.46 30.61,13.59
  Top 0.508: 32.38,36.34 C42.2 | C42.2 32.4,31.64 31.5,30.73 31.5,29.88 R6.2 R7.2 31.24,28.11 31.24,22.23 31.24,20.52 31.24,14.22 30.61,13.59 30.29,13.27 29.84,12.83 24.24,12.83 C27.2 | C42.2 28.7,36.32 23.5,36.32 19.54,36.32 | C37.2 6.1,20.69 6.1,19.81 5.33,19.05 3.3,19.05 2.03,20.32 2.03,28.45 2.03,36.7 2.03,50.55 6.57,55.09 16.76,55.09 25.31,55.09 27.07,53.38 29.46,51.05 29.46,49.87 R3.2 R5.1 32.6,49.53 33.27,49.53 35.31,47.5 35.31,46.74 | 35.31,46.74 35.31,39.74 32.38,36.83 C42.2 | OSC1.1 32.45,18.74 | 35.31,46.74 35.53,46.63 47.27,46.63 49.53,44.37 | 49.53,44.37 C4.+ 49.66,41.63 U3.4 52.14,40 L4.2 | 49.53,44.37 49.53,44.58 52.07,47.12 J2.14
  Bottom 0.203: v57.4,12.45 31.11,12.45 v30.86,12.7 | v45.47,35.56 45.21,35.81 45.21,39.37 v47.62,41.78
-15V  (via drill 0.33)
  Top 0.203: 52.56,30.37 52.05,30.37 51.44,30.99 51.44,34.04 50.55,34.92 50,34.92 RD3.2 | J1.P$1 59.44,8.39 | 59.44,8.39 v62.36,11.3 | J1.P$3 59.04,7.99 59.44,8.39
  Top 0.305: C23.2 52.56,30.37 | 52.7,30.23 52.58,30.35 C23.2 | U1.P$3 51.6,28.36 52.58,29.34 | 52.58,29.34 C23.2 | 52.58,29.34 53.47,29.34 v53.59,29.21
  Bottom 0.305: v53.59,29.21 55.24,27.56 55.24,23.75 52.32,20.83 52.32,19.3 55.63,16 57.66,16 v62.36,11.3
-20V
  Top 0.203: RD1.2 44.41,13.46 45.3,14.35 | J1.P$29 53.84,8 | 53.84,8 53.84,9.4 51.44,11.81 48.9,11.81 48.26,12.45 48.26,13.37 R11.1 | J1.P$27 54.24,7.6 53.84,8
  Top 0.254: C22.2 46.99,14.61 47.24,14.35 47.88,14.35 48.51,13.72 48.39,13.59 R11.1
  Top 0.305: C22.2 46.56,15.02 45.63,15.02 D8.1 45.3,14.35
CDONE  (via drill 0.33)
  Top 0.203: R7.1 29.5,28.07 v25.53,28.07 24.8,28.66 U6.43 | 36.8,48.77 J2.2 36.73,48.64 v35.81,48.64
  Bottom 0.203: v25.53,28.07 26.16,28.7 26.16,32.89 28.83,35.56 28.83,41.66 v35.81,48.64
CRESET  (via drill 0.33)
  Top 0.203: U6.44 25.19,29.16 v25.4,28.96 27.69,28.96 28.45,29.72 R6.1 | 36.78,51.82 J2.1 36.76,51.94 v35.69,51.94
  Bottom 0.203: v25.4,28.96 25.78,29.34 25.78,33.02 28.45,35.69 28.45,41.78 35.18,48.51 35.18,51.44 v35.69,51.94
EINK_CKV  (via drill 0.33)
  Top 0.203: J1.P$28 54.24,3.7 53.85,3.3 25.02,3.3 18.16,10.16 18.16,12.57 v19.18,13.59 | U6.19 19.26,17.19 v19.18,17.02
  Bottom 0.203: v19.18,13.59 18.92,13.84 18.92,16.64 19.18,16.89 v19.18,17.02
EINK_CL  (via drill 0.33)
  Top 0.203: J1.P$9 57.84,8.31 58.29,8.76 58.29,10.79 v58.04,11.05 | U6.20 19.76,17.45 19.81,17.4 19.81,16.76 19.56,16.51 v19.56,16.26
  Bottom 0.203: v58.04,11.05 56.77,11.05 56.13,11.68 55.63,11.68 54.23,10.29 21.97,10.29 20.07,12.19 20.07,15.75 v19.56,16.26
EINK_D0  (via drill 0.33)
  Top 0.203: J1.P$13 57.04,8.91 v57.28,9.14 | U6.1 10.26,17.75 v9.27,16.76
  Bottom 0.203: v57.28,9.14 57.15,9.14 56.77,8.76 13.72,8.76 10.03,12.45 10.03,16 v9.27,16.76
EINK_D1  (via drill 0.33)
  Top 0.203: J1.P$14 57.04,3.45 54.99,1.4 24.38,1.4 14.35,11.43 11.68,11.43 10.67,12.45 v10.67,12.7 | U6.2 10.76,16.98 v10.41,16.64
  Bottom 0.203: v10.67,12.7 10.67,16.38 v10.41,16.64
EINK_D2  (via drill 0.33)
  Top 0.203: J1.P$15 56.64,9.4 v57.28,10.03 | U6.3 11.26,16.68 v11.3,16.64
  Bottom 0.203: v57.28,10.03 56.39,9.14 13.84,9.14 11.3,11.68 v11.3,16.64
EINK_D3  (via drill 0.33)
  Top 0.203: J1.P$16 56.64,3.56 54.86,1.78 24.51,1.78 14.22,12.06 v12.19,12.06 | U6.4 11.76,17.2 v12.06,17.02
  Bottom 0.203: v12.19,12.06 11.81,12.45 11.81,16.26 12.06,16.51 v12.06,17.02
EINK_D4  (via drill 0.33)
  Top 0.203: J1.P$17 56.24,10.01 v56.26,10.03 | U6.7 13.26,15.03 v12.95,14.73
  Bottom 0.203: v56.26,10.03 56.01,10.03 55.5,9.53 16.26,9.53 13.97,11.81 13.97,13.72 v12.95,14.73
EINK_D5
  Top 0.203: J1.P$18 56.24,3.66 54.74,2.16 24.64,2.16 13.76,13.04 U6.8
EINK_D6  (via drill 0.33)
  Top 0.203: J1.P$19 55.84,9.05 55.63,9.27 55.63,10.79 v55.75,10.92 | U6.9 14.26,14.95 v14.48,14.73
  Bottom 0.203: v55.75,10.92 55.75,10.54 55.12,9.91 16.38,9.91 14.35,11.94 14.35,14.61 v14.48,14.73
EINK_D7  (via drill 0.33)
  Top 0.203: J1.P$20 55.84,3.77 54.61,2.54 24.77,2.54 15.24,12.06 v15.24,12.45 | U6.10 14.76,17.04 v14.99,16.76
  Bottom 0.203: v15.24,12.45 15.24,16.51 v14.99,16.76
EINK_GMODE  (via drill 0.33)
  Top 0.203: J1.P$26 54.64,3.59 53.98,2.92 24.89,2.92 17.78,10.03 17.78,14.35 17.91,14.48 v17.91,14.61 | U6.16 17.76,17.38 v17.4,17.02
  Bottom 0.203: v17.91,14.61 17.91,16.51 v17.4,17.02
EINK_LE  (via drill 0.33)
  Top 0.203: J1.P$10 57.84,3.63 v59.05,2.41 | v22.23,8.13 v22.23,10.92 | U6.21 20.26,16.57 v20.57,16.26
  Bottom 0.203: v59.05,2.41 27.94,2.41 v22.23,8.13 | v22.23,10.92 21.84,10.92 20.45,12.32 20.45,16.13 v20.57,16.26
EINK_OE  (via drill 0.33)
  Top 0.203: J1.P$11 57.44,8.42 57.91,8.89 57.91,10.29 57.02,11.18 v57.02,11.68 | U6.24 21.76,17.06 v21.97,16.89
  Bottom 0.203: v57.02,11.68 56.64,12.06 55.5,12.06 54.1,10.67 24.77,10.67 23.62,11.81 23.62,14.73 21.97,16.38 v21.97,16.89
EINK_SPH  (via drill 0.33)
  Top 0.203: J1.P$12 57.44,3.21 v57.53,3.05 | v23.11,8.13 23.11,10.54 v24.64,12.06 | U6.25 22.26,17.75 v23.11,16.89
  Bottom 0.203: v57.53,3.05 57.4,3.05 57.15,2.79 28.07,2.79 23.11,7.75 v23.11,8.13 | v24.64,12.06 24.64,15.37 v23.11,16.89
EINK_SPV  (via drill 0.33)
  Top 0.203: J1.P$30 53.84,3.8 53.72,3.68 25.15,3.68 18.67,10.16 18.67,11.68 v18.8,11.81 | U6.18 18.76,17.49 v18.29,17.02
  Bottom 0.203: v18.8,11.81 18.8,11.94 18.54,12.19 18.54,16.76 v18.29,17.02
GND  (via drill 0.33, 0.33 pad 0.69)  (137 unrouted)
  Top 0.203: 53.09,9.02 53.44,8.66 J1.P$31 J1.P$32 | J1.P$8 58.24,3.73 58.29,3.68 59.05,3.56 v59.18,3.43
  Top 0.254: U1.P$48 52.34,26.56 52.2,26.42
  Top 0.279: C18.1 50.04,32.07
  other vias: 55.5,22.86 40.64,24 27.43,45.47 37.47,31.11 53.59,16.26 40.64,13.59 41.91,44.96 53.59,34.67 56.9,39.37 23.24,18.54 35.31,36.32 30.86,32.13 21.84,27.56 28.57,34.42 13.34,19.81 13.84,41.91 2.92,23.37 15.88,52.45 3.81,33.02 23.11,34.29 13.97,29.84 6.48,29.21 14.99,37.97 6.99,21.21 17.91,41.91 21.46,44.2 13.84,45.21 29.97,23.11 21.97,23.37 12.45,36.58 12.83,35.31 64.52,46.74 48.26,39.37 48.13,42.93 18.16,24.64 20.7,29.72 26.42,35.43 25.27,37.21 17.91,47.75 6.35,43.94 26.54,49.02 34.29,49.66 18.8,19.68 42.16,36.45 53.59,27.56 50.29,28.7 50.8,17.78 46.86,44.32 58.93,23.75 36.2,45.09 16.26,12.57 7.24,12.06 12.57,12.83 59.94,49.78 33.02,24 48.13,16.38 40.89,29.72 47.37,28.57 29.59,18.67 54.99,20.45 51.05,30.35 50.93,8.13 22.61,12.57 37.59,20.45 58.55,13.08
  pour Bottom: -30.48,101.6 -30.48,-6.35 83.82,-6.35 83.82,101.6
  pour Top: -35.56,106.68 -35.56,-11.43 88.9,-11.43 88.9,106.68
N$1
  Top 0.203: U1.P$14 45.31,26.06 44.96,26.42 44.96,28.41 RD5.1
N$2
  Top 0.508: U3.5 54.04,39.11 L4.1
N$5
  Top 0.279: R3.1 29.84,47.79 U5.3 29.84,43.31 31.11,42.04 U5.7
N$6
  Top 0.203: OSC1.3 27.67,14.54 R13.2
N$7
  Top 0.254: U1.P$40 54.15,22.56 56.01,20.7 57.47,20.7 L3.1 57.84,21.04 | 57.78,21.14 57.84,21.04 | D4.2 59.91,23.11 57.84,21.04
N$8
  Top 0.279: D1.C 9.93,34.29 U6.75
N$9
  Top 0.508: U2.5 62.67,40.13 L2.1
N$10
  Top 0.279: R5.2 32.38,47.79 U5.1 33.22,46.32 R4.1
N$14  (via drill 0.33)  (1 unrouted)
  Top 0.254: C7.1 56.24,25.15 55.16,24.06 U1.P$43 U1.P$42 | U1.P$37 54.21,21.06 v54.36,21.21 | 56.85,23.04 D4.1 56.85,22.68 v56.26,22.1
  Top 0.279: C8.1 C7.1 56.9,24.89 56.9,23.5 56.91,23.38
  Bottom 0.254: v54.36,21.21 55.37,21.21 v56.26,22.1
N$18
  Top 0.254: U1.P$34 51.6,19.13 C10.1
  Top 0.279: D6.1 53.09,17.71 C10.1
N$20
  Top 0.254: U1.P$36 53.65,20.27 54.48,19.43 C9.1
N$21
  Top 0.254: D6.3 56.26,17.91 56.26,19.16 C9.2
N$22
  Top 0.254: U1.P$33 51.1,19.01 51.56,18.54 51.56,15.33 R10.1 R9.1
  Top 0.279: 51.85,15.16 R10.1
N$23
  Top 0.254: 43.05,15.88 43.05,18.16 43.43,18.54 44.4,18.54 C20.2
  Top 0.279: 43.05,15.88 43.18,15.95 D8.3
N$24
  Top 0.254: U1.P$25 41.47,20.27 L1.2 40.77,18.93 40.77,18.29 39.56,17.08 D7.1
N$25
  Top 0.254: U1.P$26 47.62,20.24 47.62,19.68 47.5,19.56 43.81,19.56 42.42,18.16 42.42,17.53 41.85,16.95 D7.2 41.45,16.26 C15.2 | 43.88,25.06 C16.2 43.8,25.15 45.59,25.15 45.68,25.06 U1.P$16 | 43.95,22.06 C17.2 44.16,21.84 45.59,21.84 45.81,22.06 U1.P$22
  Top 0.279: 46.66,25.06 48.26,25.06 | 48.26,25.06 48.6,25.06 U1.EP16 | U1.EP16 U1.EP | 46.66,22.06 49.1,22.06 U1.EP6 | U1.EP7 48.1,22.06 U1.P$27 U1.P$26 47.6,20.29 47.62,20.32 | 51.1,27 51.1,24.79 51.35,24.54 U1.EP2 | U1.EP2 U1.EP1 | U1.EP2 U1.EP14 | U1.EP14 U1.EP12 | U1.EP16 U1.EP13 | U1.EP13 U1.EP15 | U1.EP14 U1.EP15 | U1.EP2 U1.EP3 U1.EP4 | U1.EP5 U1.EP15 | U1.EP6 U1.EP13 | U1.EP7 U1.EP6 | U1.EP8 U1.EP7 | U1.EP9 U1.EP10 | U1.EP10 U1.EP11 | U1.EP10 48.35,25.15 48.26,25.06
N$26
  Top 0.254: U1.P$7 49.6,29.67 C18.2
N$27
  Top 0.254: U1.P$1 52.6,27.45 | 52.6,27.45 52.58,27.43 | 52.6,27.45 53.72,28.57 54.1,28.57 54.61,29.08 C19.2
N$28
  Top 0.254: U1.P$30 49.6,17.96 C21.2 48.75,18.27 47.12,16.64 45.64,16.64 D8.2
N$29
  Top 0.203: U1.P$9 48.6,34.63 RD3.1
N$31
  Top 0.254: U1.P$28 48.6,19.77 47.88,19.05 46.69,19.05 C20.1
N$32
  Top 0.254: U1.P$31 50.1,15.26 R12.2 R11.2
N$33  (via drill 0.33)
  Top 0.203: U1.P$29 49.1,19.63 47.24,17.78 v47.24,17.65 | v43.69,14.73 43.69,14.57 RD1.1
  Bottom 0.203: v47.24,17.65 46.61,17.65 v43.69,14.73
N$34  (via drill 0.33)
  Top 0.203: 46.66,23.56 45.66,23.56 45.34,23.24 v44.7,23.24 | RD4.2 59.48,12.36 v59.44,12.32
  Bottom 0.203: v44.7,23.24 45.34,23.24 47.12,21.46 47.12,19.56 52.96,13.72 57.02,13.72 58.42,12.32 v59.44,12.32
N$35  (via drill 0.33)
  Top 0.254: U1.P$35 52.1,19.79 52.58,19.3 v53.34,19.3 | v58.8,18.16 60.11,18.16 RD2.2
  Bottom 0.254: v53.34,19.3 54.48,18.16 v58.8,18.16
N$57
  Top 0.254: U1.P$47 54.76,26.06 55.37,26.67 55.37,28.7 55.88,29.21 55.88,32 56.13,32.26 R23.2
  Top 0.305: R27.2 R23.2
NINT  (via drill 0.33)
  Top 0.203: U1.P$2 52.1,27.84 v52.58,28.32 | 49.66,48.61 J2.12 48.64,47.85 v48.64,47.5
  Bottom 0.203: v52.58,28.32 52.58,29.84 51.18,31.24 45.34,31.24 44.83,31.75 44.83,40.64 48.64,44.45 v48.64,47.5
PWREN  (via drill 0.33)
  Top 0.203: J2.13 52.65,51.87 53.09,51.44 53.09,46.35 | 53.09,46.35 52.2,45.47 52.2,44.29 U3.3 | 53.09,46.35 v54.74,46.35 | v59.56,44.32 60.67,44.32 U2.3
  Bottom 0.203: v54.74,46.35 57.53,46.35 v59.56,44.32
PWRUP  (via drill 0.33)
  Top 0.203: U1.P$21 45.3,22.56 v45.21,22.48 | v43.56,47.5 43.56,47.85 J2.8
  Bottom 0.203: v45.21,22.48 44.32,22.48 43.31,23.5 43.31,46.99 v43.56,47.5
SA0  (via drill 0.33)
  Top 0.203: v10.79,44.45 10.79,46.86 12.45,48.51 19.05,48.51 24.15,53.61 24.4,53.61 U7.1 | U6.79 9.33,30.66 9.65,30.99 v10.79,30.99
  Bottom 0.203: v10.79,44.45 10.54,44.2 10.54,31.24 v10.79,30.99
SA1  (via drill 0.33)
  Top 0.203: v10.03,44.83 10.03,46.61 12.32,48.9 18.92,48.9 23.6,53.57 U7.2 | U6.80 9.46,30.16 9.65,30.35 v11.43,30.35
  Bottom 0.203: v10.03,44.83 10.03,44.32 10.16,44.2 10.16,30.73 10.54,30.35 v11.43,30.35
SA2  (via drill 0.33)
  Top 0.203: v9.27,45.21 9.27,46.35 12.19,49.28 18.8,49.28 22.8,53.28 U7.3 | U6.81 9.34,29.66 9.4,29.72 v10.79,29.72
  Bottom 0.203: v9.27,45.21 9.27,44.58 9.78,44.07 9.78,30.23 10.29,29.72 v10.79,29.72
SA3  (via drill 0.33)
  Top 0.203: v8.51,45.59 8.51,46.1 12.06,49.66 18.67,49.66 22,52.99 U7.4 | U6.82 10.08,29.16 v10.16,29.08
  Bottom 0.203: v8.51,45.59 8.51,44.83 9.4,43.94 9.4,29.46 9.78,29.08 v10.16,29.08
SA4  (via drill 0.33)
  Top 0.203: v7.75,45.97 7.87,45.97 11.94,50.04 18.54,50.04 21.2,52.7 U7.5 | U6.83 9.44,28.66 v9.78,28.32
  Bottom 0.203: v7.75,45.97 7.75,45.09 9.02,43.81 9.02,29.08 v9.78,28.32
SA5  (via drill 0.33)
  Top 0.203: U7.18 10.8,52.95 v10.92,52.83 | v3.3,30.1 4.57,30.1 6.99,27.69 8.43,27.69 U6.85
  Bottom 0.203: v10.92,52.83 10.92,52.2 10.16,51.44 7.49,51.44 3.05,46.99 3.05,30.35 v3.3,30.1
SA6  (via drill 0.33)
  Top 0.203: U7.19 10,52.23 v10.03,52.2 | v3.3,29.21 4.95,29.21 6.99,27.18 8.44,27.18 U6.86
  Bottom 0.203: v10.03,52.2 10.03,52.07 9.78,51.82 7.37,51.82 2.67,47.12 2.67,29.84 v3.3,29.21
SA7  (via drill 0.33)
  Top 0.203: U7.20 9.2,53.03 v9.4,52.83 | v3.3,28.32 5.33,28.32 6.99,26.67 8.45,26.67 U6.87
  Bottom 0.203: v9.4,52.83 8.76,52.2 7.24,52.2 2.29,47.24 2.29,29.34 v3.3,28.32
SA8  (via drill 0.33)
  Top 0.203: v4.95,37.59 4.7,37.85 4.7,45.34 8,48.64 8,52.96 8.4,53.36 U7.21 | U6.89 8.45,25.65 7.24,25.65 6.73,25.15 v5.97,25.15
  Bottom 0.203: v4.95,37.59 4.95,36.45 5.71,35.69 5.71,25.4 v5.97,25.15
SA9  (via drill 0.33)
  Top 0.203: U7.22 7.6,48.75 4.32,45.47 4.32,37.21 v4.19,37.08 | v5.08,24.51 6.6,24.51 7.24,25.15 8.44,25.15 U6.90
  Bottom 0.203: v4.19,37.08 4.19,36.58 5.33,35.43 5.33,24.77 v5.08,24.51
SA10  (via drill 0.33)
  Top 0.203: v7.62,40.01 7.6,40.11 8,40.39 8,41.91 7.6,42.31 U7.23 | U6.91 9.37,24.66 9.53,24.51 v14.99,24.51
  Bottom 0.203: v7.62,40.01 7.87,40.01 8.64,39.24 8.64,25.53 8.89,25.27 14.73,25.27 14.99,25.02 v14.99,24.51 14.88,24.54
SA11  (via drill 0.33)
  Top 0.203: U7.24 8.4,39.9 7.87,39.37 7.24,39.37 v7.11,39.24 | v14.35,23.88 9.53,23.88 9.27,23.62 8.5,23.62 U6.93
  Bottom 0.203: v7.11,39.24 7.24,39.24 8.26,38.23 8.26,25.02 8.64,24.64 14.1,24.64 14.35,24.38 v14.35,23.88
SA12  (via drill 0.33)
  Top 0.203: v6.6,38.48 8,38.48 8.76,39.24 8.76,41.66 9.2,42.09 U7.25 | U6.94 9.45,23.16 9.53,23.24 v13.72,23.24
  Bottom 0.203: v6.6,38.48 7.87,37.21 7.87,24.51 8.38,24 13.46,24 13.72,23.75 v13.72,23.24
SA13  (via drill 0.33)
  Top 0.203: v6.35,37.59 7.62,37.59 9.14,39.12 9.14,41.4 10,42.26 U7.26 | U6.95 13.03,22.66 v13.08,22.61
  Bottom 0.203: v6.35,37.59 7.49,36.32 7.49,24.13 8.26,23.37 12.83,23.37 13.08,23.11 v13.08,22.61
SA14  (via drill 0.33)
  Top 0.203: v6.1,36.7 6.35,36.96 7.49,36.96 9.53,38.99 9.53,41.27 10.8,42.55 U7.27 | U6.96 12.26,22.16 v12.45,21.97
  Bottom 0.203: v6.1,36.7 7.11,35.69 7.11,23.37 7.75,22.73 12.19,22.73 12.45,22.48 v12.45,21.97
SA15  (via drill 0.33)
  Top 0.203: U7.42 22.8,42.09 v22.99,41.91 | U6.97 9.71,21.66 v9.91,21.46
  Bottom 0.203: v22.99,41.91 22.99,41.27 23.75,40.51 23.75,31.62 21.08,28.96 18.16,28.96 16.13,26.92 16.13,24.51 12.83,21.21 11.43,21.21 10.92,21.59 10.03,21.59 v9.91,21.46
SA16  (via drill 0.33)
  Top 0.203: U7.43 23.6,41.68 v23.75,41.53 | U6.99 10.38,20.66 v10.54,20.83
  Bottom 0.203: v23.75,41.53 24.13,41.15 24.13,31.5 21.21,28.57 18.29,28.57 16.51,26.8 16.51,24.38 12.95,20.83 v10.54,20.83
SA17  (via drill 0.33)
  Top 0.203: U7.44 24.4,42.02 v24.51,41.91 | U6.100 11.14,20.16 v11.18,20.19
  Bottom 0.203: v24.51,41.91 24.51,31.37 21.34,28.19 18.41,28.19 16.89,26.67 16.89,24.26 13.08,20.45 11.43,20.45 v11.18,20.19
SCL  (via drill 0.33)
  Top 0.203: U1.P$17 45.01,24.56 v45.09,24.51 | v46.1,47.5 46.1,47.85 J2.10
  Bottom 0.203: v45.09,24.51 44.07,25.4 44.07,40.89 46.1,42.93 v46.1,47.5
SD0  (via drill 0.33)
  Top 0.203: U7.7 19.6,52.79 v19.56,52.7 | U6.62 16.76,36.95 v17.02,37.08
  Bottom 0.203: v19.56,52.7 16.76,49.91 16.76,37.34 v17.02,37.08
SD1  (via drill 0.33)
  Top 0.203: U7.8 18.8,52.83 v18.67,52.7 | U6.63 16.26,33.02 v16.64,32.64
  Bottom 0.203: v16.64,32.64 16.38,32.89 16.38,50.04 18.67,52.32 v18.67,52.7
SD2  (via drill 0.33)
  Top 0.203: U7.9 18,52.48 v17.78,52.32 | v16.26,31.88 16.01,32.01 16.01,32.76 15.75,33.02 15.75,33.95 U6.64
  Bottom 0.203: v16.26,31.88 16,32 16,50.16 17.78,51.94 v17.78,52.32
SD3  (via drill 0.33)
  Top 0.203: U6.65 15.26,35.2 v15.37,35.31 | U7.10 17.2,52.89 v17.02,52.7
  Bottom 0.203: v17.02,52.7 17.02,51.69 15.62,50.29 15.62,35.43 v15.37,35.31
SD4  (via drill 0.33)
  Top 0.203: U7.13 14.8,52.89 v14.86,52.83 | U6.66 14.73,33.94 14.73,33.15 v15.37,32.51
  Bottom 0.203: v14.86,52.83 14.86,52.07 13.97,51.18 13.97,46.86 12.95,45.85 12.95,38.48 14.73,36.7 14.73,33.15 v15.37,32.51
SD5  (via drill 0.33)
  Top 0.203: U7.14 14,52.42 v14.1,52.32 | U6.68 13.76,33.11 14.35,32.51 v14.48,32.51
  Bottom 0.203: v14.48,32.51 14.35,32.64 14.35,36.58 12.57,38.35 12.57,45.97 13.59,46.99 13.59,51.82 v14.1,52.32
SD6  (via drill 0.33)
  Top 0.203: U7.15 13.2,52.97 v13.34,52.83 | U6.69 13.26,32.97 13.72,32.51 v13.72,32.13
  Bottom 0.203: v13.72,32.13 13.72,33.02 13.97,33.27 13.97,36.45 12.19,38.23 12.19,46.1 13.21,47.12 13.21,52.7 v13.34,52.83
SD7  (via drill 0.33)
  Top 0.203: U7.16 12.4,52.53 v12.57,52.32 | U6.71 12.26,32.96 12.83,32.38 v12.83,32.26
  Bottom 0.203: v12.83,32.26 12.83,32.77 13.59,33.53 13.59,36.32 11.81,38.1 11.81,46.23 12.83,47.24 12.83,52.2 12.7,52.32 v12.57,52.32
SD8  (via drill 0.33)
  Top 0.203: U7.29 12.4,42.25 12.32,42.16 11.56,42.16 11.43,42.04 11.43,41.82 arc-90 11.14,41.53 10.83,41.53 arc90 10.54,41.24 10.54,41.12 arc90 10.83,40.83 12.03,40.83 arc-90 12.32,40.53 12.32,40.42 arc-90 12.03,40.12 10.83,40.12 arc90 10.54,39.83 10.54,39.72 arc90 10.83,39.42 12.03,39.42 arc-90 12.32,39.13 12.32,39.01 arc-90 12.03,38.72 10.83,38.72 arc90 10.54,38.43 10.54,38.31 arc90 10.83,38.02 12.03,38.02 arc-90 12.32,37.73 12.32,37.61 arc-90 12.03,37.32 10.83,37.32 arc90 10.54,37.02 10.54,36.91 arc90 10.83,36.61 11.52,36.61 v11.56,36.58 | v11.94,32.26 11.81,32.38 11.81,33.91 U6.72
  Bottom 0.203: v11.56,36.58 11.94,36.2 v11.94,32.26
SD9  (via drill 0.33)
  Top 0.203: U6.60 17.76,30.63 v18.03,30.35 | v18.29,40.26 13.59,40.26 13.2,40.65 U7.30
  Bottom 0.203: v18.29,40.26 18.29,39.24 18.67,38.86 18.67,32.77 17.78,31.88 17.78,30.61 v18.03,30.35
SD10  (via drill 0.33)
  Top 0.203: U7.31 14,43.97 v14.1,44.07 | U6.59 18.29,33.93 18.29,31.5 v18.67,31.11 | v14.35,39.62 v18.92,39.62
  Bottom 0.203: v18.92,39.62 19.05,39.37 19.05,32.64 18.54,32.13 18.54,31.24 v18.67,31.11 | v14.1,44.07 14.86,43.31 14.86,40.13 v14.35,39.62
SD11  (via drill 0.33)
  Top 0.203: U7.32 14.8,44.39 v14.99,44.58 | v14.99,38.99 19.56,38.99 v19.68,39.12 | U6.57 19.26,31.96 v19.18,31.88
  Bottom 0.203: v19.68,39.12 19.94,38.86 19.94,32.89 19.3,32.13 v19.18,31.88 | v14.99,44.58 15.24,44.32 15.24,39.24 v14.99,38.99
SD12  (via drill 0.33)
  Top 0.203: U6.56 19.76,33.08 19.81,33.02 19.81,31.37 v19.56,31.11 | U7.35 17.2,45.14 v17.91,45.85
  Bottom 0.203: v17.91,45.85 17.91,44.58 20.32,42.16 20.32,31.88 v19.56,31.11
SD13  (via drill 0.33)
  Top 0.203: U6.54 20.76,31.31 v20.57,31.11 | U7.36 18,45.05 v18.8,45.85
  Bottom 0.203: v20.57,31.11 20.7,31.24 20.7,42.29 18.8,44.2 v18.8,45.85
SD14  (via drill 0.33)
  Top 0.203: U6.53 21.26,31.96 v21.46,31.75 | U7.37 18.8,44.33 v20.19,45.72
  Bottom 0.203: v21.46,31.75 21.08,32.13 21.08,42.42 19.43,44.07 19.43,44.96 v20.19,45.72
SD15  (via drill 0.33)
  Top 0.203: U7.38 19.56,42.96 19.56,43.94 v20.07,44.45 | U6.52 21.76,32.73 21.97,32.51 v22.1,32.51
  Bottom 0.203: v22.1,32.51 22.23,32.51 22.35,32.64 22.35,35.43 arc-90 22.64,35.73 22.95,35.73 arc90 23.24,36.02 23.24,36.23 arc90 22.95,36.52 21.75,36.52 arc-90 21.46,36.82 21.46,37.03 arc-90 21.75,37.32 22.95,37.32 arc90 23.24,37.62 23.24,37.83 arc90 22.95,38.12 21.75,38.12 arc-90 21.46,38.41 21.46,38.63 arc-90 21.75,38.92 22.95,38.92 arc90 23.24,39.21 23.24,39.43 arc90 22.95,39.72 22.64,39.72 arc-90 22.35,40.01 22.35,42.16 v20.07,44.45
SDA  (via drill 0.33)
  Top 0.203: U1.P$18 45.53,24.06 45.34,23.88 44.32,23.88 v44.2,24 | v45.85,51.94 46.92,51.94 J2.9
  Bottom 0.203: v44.2,24 43.69,24.51 43.69,41.02 45.47,42.8 45.47,51.56 v45.85,51.94
SPI_SCK  (via drill 0.33)
  Top 0.203: U5.6 29.84,40.13 v30.23,40.51 | v29.97,31.62 29.97,31.59 29.54,31.16 U6.48 24.01,31.11 | 41.86,51.82 J2.5 41.84,51.94 v40.77,51.94
  Bottom 0.203: v29.97,31.62 29.97,40.26 v30.23,40.51 30.48,40.77 38.48,40.77 40.39,42.67 40.39,51.56 v40.77,51.94
SPI_SDI  (via drill 0.33)
  Top 0.203: U5.2 31.11,43.05 v31.37,42.8 | v26.8,30.48 26.48,30.16 U6.46 23.99,30.1 | 39.32,51.82 J2.3 39.3,51.94 v38.23,51.94
  Bottom 0.203: v26.8,30.48 27.43,30.48 29.21,32.26 29.21,41.53 30.48,42.8 v31.37,42.8 32.64,41.53 35.43,41.53 37.85,43.94 37.85,51.56 v38.23,51.94
SPI_SDO  (via drill 0.33)
  Top 0.203: U5.5 28.57,40.01 v29.84,41.27 | v27.43,29.84 27.25,29.66 U6.45 23.98,29.59 | v38.48,47.5 38.48,47.85 J2.4
  Bottom 0.203: v27.43,29.84 27.43,29.97 29.59,32.13 29.59,41.02 v29.84,41.27 29.97,41.27 30.1,41.15 35.56,41.15 38.48,44.07 v38.48,47.5
SPI_SS_B  (via drill 0.33)
  Top 0.203: v34.29,40.13 34.29,44.45 34.16,44.58 R4.2 | U6.49 29.12,31.66 v30.61,33.15 | v41.02,47.5 41.02,47.85 J2.6
  Bottom 0.203: v30.61,33.15 30.35,33.4 30.35,39.24 31.5,40.39 33.91,40.39 v34.29,40.13 34.42,40.13 34.67,40.39 38.61,40.39 41.02,42.8 v41.02,47.5
SPI_SS_E  (via drill 0.33)
  Top 0.203: U6.37 25.27,25.66 v25.53,25.4 | 44.4,51.82 J2.7 44.38,51.94 v43.31,51.94
  Bottom 0.203: v25.53,25.4 30.86,25.4 34.67,29.21 34.67,38.23 36.45,40.01 41.15,40.01 42.93,41.78 42.93,51.56 v43.31,51.94
SRAM_CS  (via drill 0.33)
  Top 0.203: U7.6 20.4,53 v20.45,52.83 | v16.26,30.61 16,30.86 11.81,30.86 11.05,31.62 9.78,31.62 9.32,31.16 U6.78
  Bottom 0.203: v20.45,52.83 20.45,52.58 17.14,49.28 17.14,39.37 17.91,38.61 17.91,33.02 17.02,32.13 17.02,31.37 v16.26,30.61
SRAM_OE  (via drill 0.33)
  Top 0.203: U7.41 22,42.07 20.95,41.02 v19.68,41.02 | 10.79,34 U6.74 10.76,33.06 v11.18,32.64
  Bottom 0.203: v19.68,41.02 17.78,41.02 17.53,40.77 17.53,39.5 18.29,38.73 18.29,32.89 17.4,32 17.4,30.35 16.89,29.97 14.99,29.97 13.84,31.11 12.06,31.11 11.18,32 v11.18,32.64
SRAM_WE  (via drill 0.33)
  Top 0.203: U7.17 11.6,52.02 v11.43,51.82 | v11.18,35.31 11.3,35.18 11.3,33.91 U6.73
  Bottom 0.203: v11.43,51.82 11.43,37.97 10.92,37.47 10.92,35.56 v11.18,35.31
SYSCLK
  Top 0.203: R13.1 25.4,18.41 24.38,18.41 22.48,20.32 18.29,20.32 17.26,19.29 U6.15
VCC
  Top 0.254: U1.P$10 48.1,29.64 C13.1
  Top 0.305: C13.1 47.1,29.92 47.1,30.37 46.35,31.11 46.35,37.02 46.86,37.53 | 46.66,21.06 42.44,21.06 42.16,21.34 40.21,21.34 C14.2
  Top 0.508: 44.62,36.03 44.17,35.58 | 44.17,35.58 37.34,28.77 37.34,22.86 38.04,22.16 39.26,22.16 C14.2 | 62.61,37.53 64.2,37.53 64.39,37.85 64.39,44.83 63.75,45.47 62.61,45.47 | 62.61,37.53 57.15,37.53 | 57.15,37.53 46.86,37.53 46.12,37.53 44.17,35.58 | L3.2 61.64,21.7 C6.1 62.36,23.5 60.71,25.15 60.71,35.62 62.61,37.53 | 62.61,45.47 60.96,45.47 60.45,45.97 60.45,47.01 C1.+ | U2.1 62.67,45.27 62.61,45.47 | 55.24,45.47 56.01,44.7 56.01,38.67 57.15,37.53 | U3.1 54.04,45.15 54.36,45.47 55.24,45.47 | 55.24,45.47 56.9,47.12 C3.+ 55.68,48.74 J2.16
VCOM  (via drill 0.33)
  Top 0.203: J1.P$23 55.04,7.87 | 55.04,7.87 55.04,12.78 v54.74,13.08 | J1.P$21 55.44,7.47 55.04,7.87
  Top 0.254: C24.2 44.2,27.3 44.58,26.92 44.58,26.04 45.05,25.56 U1.P$15
  Top 0.305: C24.2 43.55,28.34 43.31,28.57 v42.67,28.57
  Bottom 0.305: v42.67,28.57 42.8,28.45 42.8,23.24 53.09,12.95 54.61,12.95 v54.74,13.08
WAKEUP  (via drill 0.33)
  Top 0.203: U1.P$5 50.6,27.99 51.31,28.7 v51.31,29.08 | 49.28,52 J2.11 49.46,51.94 v48.39,51.94
  Bottom 0.203: v51.31,29.08 50.67,29.72 46.35,29.72 44.45,31.62 44.45,40.77 48.01,44.32 48.01,51.56 v48.39,51.94
(copper drawn outside any net)
  shapes: Bottom area x1

### Text on the board
tNames: eink controller
bNames: rev 0 2016-08-24